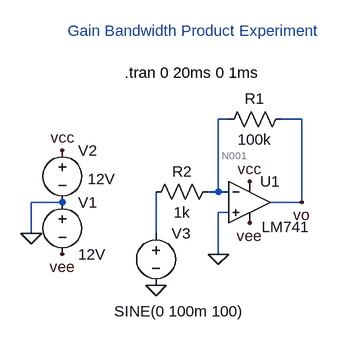
[diagram p0: schematic gainbandwidthproduct.asc]
gainbandwidthproduct.asc, the LTspice schematic file:
Version 4.1
SHEET 1 880 680
WIRE 176 48 160 48
WIRE 288 48 256 48
WIRE 160 160 160 48
WIRE 160 160 144 160
WIRE 176 160 160 160
WIRE -80 176 -128 176
WIRE 288 176 288 48
WIRE 288 176 240 176
WIRE 176 192 160 192
WIRE -128 224 -128 176
WIRE 64 224 64 160
WIRE 160 256 160 192
FLAG -128 224 0
FLAG -80 96 vcc
FLAG -80 256 vee
FLAG 208 144 vcc
FLAG 208 208 vee
FLAG 160 256 0
FLAG 64 304 0
FLAG 288 176 vo
SYMBOL LM741 208 112 R0
WINDOW 3 19 102 Left 2
SYMATTR InstName U1
SYMBOL voltage -80 160 R0
WINDOW 123 0 0 Left 0
WINDOW 39 0 0 Left 0
SYMATTR InstName V1
SYMATTR Value 12V
SYMBOL voltage -80 80 R0
WINDOW 3 39 60 Left 2
WINDOW 123 0 0 Left 0
WINDOW 39 0 0 Left 0
SYMATTR Value 12V
SYMATTR InstName V2
SYMBOL res 272 32 R90
WINDOW 0 0 56 VBottom 2
WINDOW 3 32 56 VTop 2
SYMATTR InstName R1
SYMATTR Value 100k
SYMBOL res 160 144 R90
WINDOW 0 0 56 VBottom 2
WINDOW 3 32 56 VTop 2
SYMATTR InstName R2
SYMATTR Value 1k
SYMBOL voltage 64 208 R0
WINDOW 123 24 124 Left 2
WINDOW 39 0 0 Left 0
WINDOW 3 -64 136 Left 2
SYMATTR InstName V3
SYMATTR Value SINE(0 100m 100)
TEXT -72 -88 Left 2 ;Gain Bandwidth Product Experiment
TEXT 16 -24 Left 2 !.tran 0 20ms 0 1ms

The netlist it stands for:
* gainbandwidthproduct.asc
X§U1 0 N001 vcc vee vo LM741  ; pins In+ In- V+ V- OUT
V1 0 vee 12V
V2 vcc 0 12V
R1 vo N001 100k
R2 N001 N002 1k
V3 N002 0 SINE(0 100m 100)
* Gain Bandwidth Product Experiment
.tran 0 20ms 0 1ms
.lib LM741.lib
.backanno
.end

* Results of the author's LTspice run, read from the files saved beside the schematic
* Operating Point, zero values left out:
*   V(vcc) = 12 V
*   V(vo) = 111.1 mV
*   V(n001) = 999.5 µV
*   V(vee) = -12 V
*   I(V1) = -1.626 mA
*   I(R2) = 999.5 nA
*   I(V2) = -1.627 mA
*   I(R1) = 1.101 µA
*   I(V3) = 999.5 nA
*   Ix(u1:1) = 57.86 nA
*   Ix(u1:2) = 101.9 nA
*   Ix(u1:99) = 1.627 mA
*   Ix(u1:50) = -1.626 mA
*   Ix(u1:28) = -1.101 µA